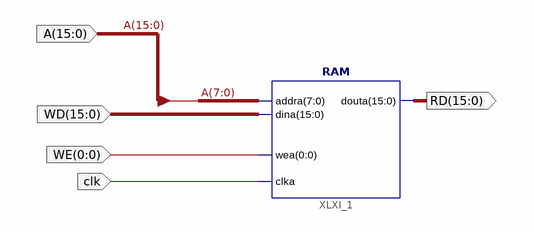
[diagram p0: schematic sheet 1]
// Xilinx ISE schematic IRAMAD.sch (spartan3e) as structural Verilog: 1 symbols, 5 ports
module IRAMAD (
  input  clk,
  input  [0:0] WE,
  input  [15:0] WD,
  input  [15:0] A,
  output [15:0] RD
);

  RAM XLXI_1 (.addra(A[7:0]), .dina(WD), .wea(WE[0]), .clka(clk), .douta(RD));
endmodule
